# Altium schematic sheet BackBoard.SchDoc
size A4; SheetNumber: 1; SheetTotal: 1
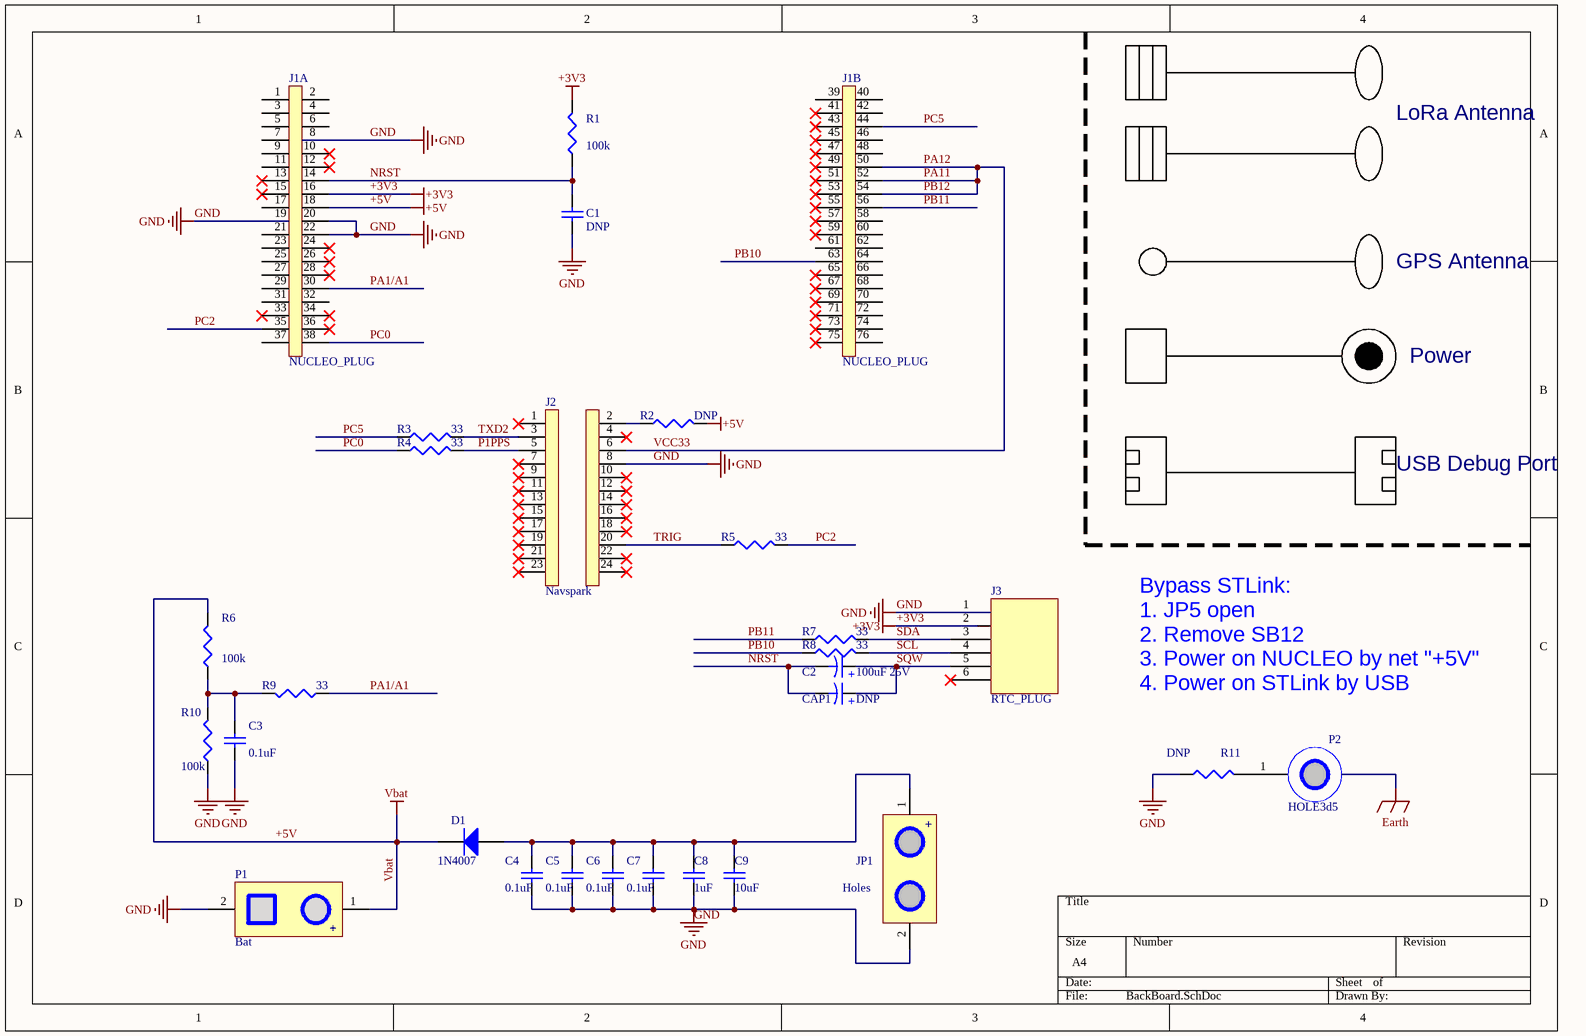
[diagram p0: BackBoard.SchDoc]

## Parts
C1  DNP  [C0805]
C2  value 100uF 25V  [C7343]  (hidden comment: 100u 25V)
C3  0.1: 0.1uF  [C0805]  (hidden comment: 0.1u)
C4  0.1: 0.1uF  [C0805]  (hidden comment: 0.1u)
C5  0.1: 0.1uF  [C0805]  (hidden comment: 0.1u)
C6  0.1: 0.1uF  [C0805]  (hidden comment: 0.1u)
C7  0.1: 0.1uF  [C0805]  (hidden comment: 0.1u)
C8  1: 1uF  [C0805]  (hidden comment: 1u)
C9  1: 10uF  [C1206]  (hidden comment: 10u)
CAP1  DNP  [CP2V_D10R0_5R0]
D1  1N4007  [2D7X2]
J1  NUCLEO_PLUG  [38pX2]  (parts A,B of 2)
J2  Navspark  [12pX2_2d54_15d24]
J3  RTC_PLUG  [2D54_6P_FEMALE_SMT]
JP1  Holes  [3D81X2]
P1  Bat  [MY_2PIN]
P2  HOLE3d5  [I3D5_O6MM]
R1  100k  [R0805]
R2  DNP  [R0805]
R3  33  [R0805]
R4  33  [R0805]
R5  33  [R0805]
R6  100k  [R0805]
R7  33  [R0805]
R8  33  [R0805]
R9  33  [R0805]
R10  100k  [R0805]
R11  DNP  [R0805]

## Nets
+3V3: R1.2
+5V: D1.2(K) R2.2 R6.2  [also labelled Vbat]
GND: C1.1 C3.1 C4.1 C5.1 C6.1 C7.1 C8.1 C9.1 J1.8 J1.19 J3.1 R10.1 R11.1
NRST: C1.2 C2.2 CAP1.2 R1.1
P1PPS: R4.2
PA1/A1: R9.1
PB10: R8.1
PB11: R7.1
PC0: R4.1
PC2: R5.2
PC5: R3.1
SCL: R8.2
SDA: R7.2
SQW: C2.1 CAP1.1
TRIG: R5.1
TXD2: R3.2
NetC3_2: C3.2 R6.1 R9.2 R10.2
NetC4_2: C4.2 C5.2 C6.2 C7.2 C8.2 C9.2 D1.1(A)

Not connected (* = marked no-connect by the designer): J1 1 2 3 4 5 6 7 9 10 11 12 13 14 15 16 17 18 20 21 22 23 24 25 26 27 28 29 30 31 32 33 34 35 36 37 38 39 40 41 42 43 44 45 46 47 48 49 50 51 52 53 54 55 56 57 58 59 60 61 62 63 64 65 66 67 68 69 70 71 72 73 74 75 76; J2 1 2 3 4 5 6 7 8 9 10 11 12 13 14 15 16 17 18 19 20 21 22 23 24; J3 2(3) 3 4 5 6; JP1 1 2; P1 1 2; P2 1; R2 1; R11 2

## Notes on the sheet
- LoRa Antenna
- GPS Antenna
- Power
- USB Debug Port
- Bypass STLink:
  1. JP5 open
  2. Remove SB12
  3. Power on NUCLEO by net "+5V"
  4. Power on STLink by USB
- Labels drawn without touching a wire or pin: GND
- (in symbol 100u 25V) +
- (in symbol Aluminum electrolytic capacitor) +
- (in symbol Bat) +
- (in symbol Holes) +

## Library data of the parts
C1 = Capacitor: Published: 8-Jun-2000; LatestRevisionDate: 17-Jul-2002; LatestRevisionNote: Re-released for DXP Platform.; PackageReference: RAD-0.3; Publisher: Altium Limited; PackageDescription: Radial Cap, Thru-Hole; 2 Leads; 0.3 in Pin Spacing; 1: DNP
C2 = 100u 25V: Polarized Capacitor; Published: 23-Sep-2002; PackageReference: CAPR5-4X5; Publisher: Altium Limited; PackageDescription: Capacitor; 2 Leads
C3-C7 = 0.1u: Capacitor; Published: 8-Jun-2000; LatestRevisionDate: 17-Jul-2002; LatestRevisionNote: Re-released for DXP Platform.; PackageReference: RAD-0.3; Publisher: Altium Limited; PackageDescription: Radial Cap, Thru-Hole; 2 Leads; 0.3 in Pin Spacing
C8 = 1u: Capacitor; Published: 8-Jun-2000; LatestRevisionDate: 17-Jul-2002; LatestRevisionNote: Re-released for DXP Platform.; PackageReference: RAD-0.3; Publisher: Altium Limited; PackageDescription: Radial Cap, Thru-Hole; 2 Leads; 0.3 in Pin Spacing
C9 = 10u: Capacitor; Published: 8-Jun-2000; LatestRevisionDate: 17-Jul-2002; LatestRevisionNote: Re-released for DXP Platform.; PackageReference: RAD-0.3; Publisher: Altium Limited; PackageDescription: Radial Cap, Thru-Hole; 2 Leads; 0.3 in Pin Spacing
CAP1 = Aluminum electrolytic capacitor: Polarized Capacitor; Published: 23-Sep-2002; PackageReference: CAPR5-4X5; Publisher: Altium Limited; PackageDescription: Capacitor; 2 Leads; Value: DNP
D1 = 1N4007: 1 Amp General Purpose Rectifier; Published: 8-Jun-2000; LatestRevisionDate: 17-Jul-2002; LatestRevisionNote: Re-released for DXP Platform.; DatasheetVersion: 1998; PackageVersion: Aug-1999; PackageReference: DO-41; Publisher: Altium Limited; PackageDescription: Diode, Axial; Body 5.2 x 2.7 mm (LxDia. max), Lead Dia. 0.86 mm (max); Code_JEDEC: DO-204-AL; ComponentLink1Description: Manufacturer Link; ComponentLink1URL: http://www.fairchildsemi.com/; ComponentLink2Description: Datasheet; ComponentLink2URL: http://www.fairchildsemi.com/ds/1N%2F1N4001.pdf
J1 = NUCLEO_PLUG: NUCLEO
J3 = RTC_PLUG: RTC
JP1 = Holes: Power
P2 = HOLE3d5: Chassis earth
R1 R6 R10 = 100k: Resistor; Published: 8-Jun-2000; LatestRevisionDate: 29-May-2009; LatestRevisionNote: IPC-7351 Footprint Added.; PackageReference: J1-0603; Publisher: Altium Limited; PackageDescription: Chip Resistor; Value: 100k
R2 R11 = Resistor: Published: 8-Jun-2000; LatestRevisionDate: 29-May-2009; LatestRevisionNote: IPC-7351 Footprint Added.; PackageReference: J1-0603; Publisher: Altium Limited; PackageDescription: Chip Resistor; Value: DNP
R3-R5 R7-R9 = 33: Resistor; Published: 8-Jun-2000; LatestRevisionDate: 29-May-2009; LatestRevisionNote: IPC-7351 Footprint Added.; PackageReference: J1-0603; Publisher: Altium Limited; PackageDescription: Chip Resistor; Value: 33